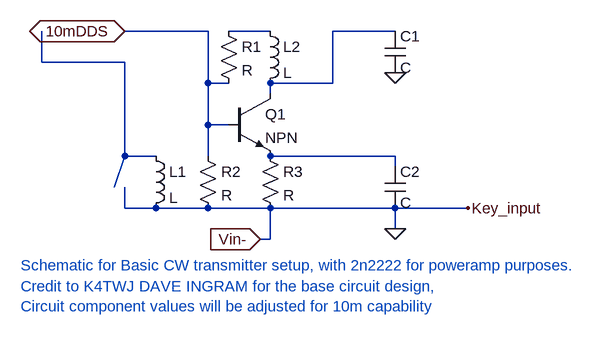
[diagram p0: schematic 10m cw transmitter draft.asc]
10m cw transmitter draft.asc, the LTspice schematic file:
Version 4.1
SHEET 1 880 680
WIRE 176 32 48 32
WIRE 272 32 208 32
WIRE 464 32 368 32
WIRE -80 80 -80 32
WIRE 48 80 -80 80
WIRE 176 112 176 32
WIRE 208 112 176 112
WIRE 368 112 368 32
WIRE 368 112 272 112
WIRE 272 128 272 112
WIRE 176 176 176 112
WIRE 208 176 176 176
WIRE 48 224 48 80
WIRE 96 224 48 224
WIRE 176 224 176 176
WIRE 464 224 272 224
WIRE 464 240 464 224
WIRE 32 272 48 224
WIRE 48 304 48 272
WIRE 96 304 48 304
WIRE 176 304 96 304
WIRE 272 304 176 304
WIRE 464 304 272 304
WIRE 576 304 464 304
WIRE 464 336 464 304
WIRE 272 352 272 304
WIRE 272 352 256 352
FLAG 48 32 10mDDS
IOPIN 48 32 BiDir
FLAG 256 352 Vin-
IOPIN 256 352 In
FLAG 464 96 0
FLAG 464 336 0
FLAG 576 304 Key_input
SYMBOL res 160 208 R0
SYMATTR InstName R2
SYMBOL ind 80 208 R0
SYMATTR InstName L1
SYMBOL ind 256 16 R0
SYMATTR InstName L2
SYMBOL res 256 208 R0
SYMATTR InstName R3
SYMBOL cap 448 32 R0
SYMATTR InstName C1
SYMBOL cap 448 240 R0
SYMATTR InstName C2
SYMBOL res 192 16 R0
SYMATTR InstName R1
SYMBOL npn 208 128 R0
SYMATTR InstName Q1
TEXT -112 392 Left 2 ;Schematic for Basic CW transmitter setup, with 2n2222 for poweramp purposes.
TEXT -112 424 Left 2 ;Credit to K4TWJ DAVE INGRAM for the base circuit design,\nCircuit component values will be adjusted for 10m capability

The netlist it stands for:
* 10m cw transmitter draft.asc
R2 10mDDS 0 R
L1 N003 0 L
L2 N001 N002 L
R3 N004 0 R
C1 N002 0 C
C2 N004 0 C
R1 N001 10mDDS R
Q1 N002 10mDDS N004 0 NPN
.model NPN NPN
.model PNP PNP
.lib standard.bjt
* Schematic for Basic CW transmitter setup, with 2n2222 for poweramp purposes.
* Credit to K4TWJ DAVE INGRAM for the base circuit design,
* Circuit component values will be adjusted for 10m capability
.backanno
.end